# EAGLE design question_3 (EAGLE 8.2.2)
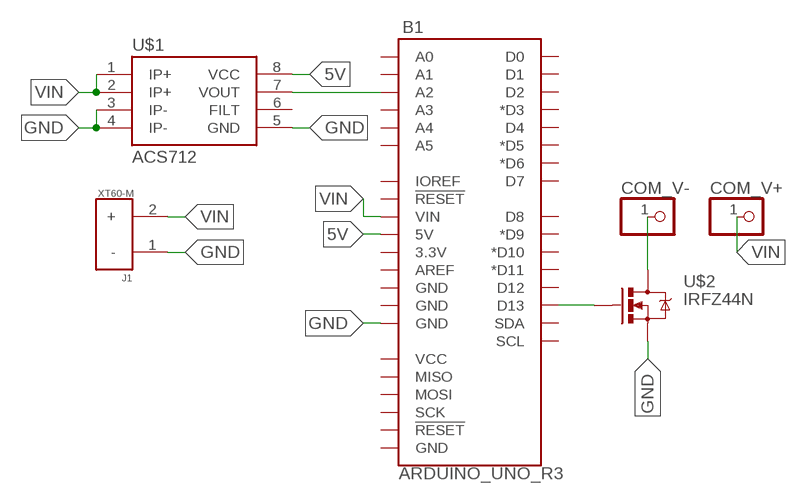
[diagram p0: schematic, sheet 1]

## Parts
B1  ARDUINO_UNO_R3  [ARDUINO_R3]
COM_V+  PINHD-1X1  [1X01]
COM_V-  PINHD-1X1  [1X01]
J1  XT60-M  [AMASS_XT60-M]
U$1  ACS712  [SO08]
U$2  IRFZ44N  [TO-220]

## Nets
5V: B1.5V U$1.8(VCC)
GND: B1.GND@2(GND) J1.1(-) U$1.3(IP-) U$1.4(IP-) U$1.5(GND) U$2.3(S)
N$1: B1.D13 U$2.1(G)
N$3: COM_V-.1 U$2.2(D)
N$5: B1.A2 U$1.7(VOUT)
VIN: B1.VIN COM_V+.1 J1.2(+) U$1.1(IP+) U$1.2(IP+)
Unconnected: B1.3.3V B1.A0 B1.A1 B1.A3 B1.A4 B1.A5 B1.AREF B1.D0 B1.D1 B1.D2 B1.D3(*D3) B1.D4 B1.D5(*D5) B1.D6(*D6) B1.D7 B1.D8 B1.D9(*D9) B1.D10(*D10) B1.D11(*D11) B1.D12 B1.GND@1(GND) B1.GND@3(GND) B1.GND@4(GND) B1.IOREF B1.MISO B1.MOSI B1.RESET@1(!RESET!) B1.RESET@2(!RESET!) B1.SCK B1.SCL B1.SDA B1.VCC U$1.6(FILT)

## Library data of the parts
B1 = SparkFun-Boards:ARDUINO_UNO_R3: Arduino R3 Footprint with SPI header Arduino Uno R3 Compatible Footprint. Matches PCB size of the original board. SparkFun Products: SAMD21 Dev Breakout <https://www.sparkfun.com/products/13672> RedBoard <https://www.sparkfun.com/products/12757> R3 Stackable Headers <https://www.sparkfun.com/products/11417>
COM_V+ COM_V- = adafruit:PINHD-1X1: Pin header 1x1 for 0.1" spacing With round pins
J1 = XT60-M:XT60-M: DC supply; XT60; male; PIN:2; for cable; soldered; 60A; 500V; AVAILABILITY: Unavailable; DESCRIPTION: Plug; DC supply; XT60; male; PIN: 2; for cable; soldered; 30A; 500V; MF: AMASS; MP: XT60-M; PACKAGE: Package; PRICE: None
U$1 = SparkFun-Sensors:ACS712: ACS712 Hall-effect-based isolated linear current sensor Datasheet <http://www.sparkfun.com/datasheets/BreakoutBoards/0712.pdf> SparkFun Products SparkFun Low Current Sensor Breakout - ACS712 <https://www.sparkfun.com/products/8883> (SEN-08883); PROD_ID: IC-08964
U$2 = IRFZ44N:IRFZ44N; AVAILABILITY: Unavailable; DESCRIPTION: N-Channel 55V 49A (Tc) 3.8W (Ta), 94W (Tc) Through Hole TO-262; MF: Infineon Technologies; MP: IRFZ44N; PACKAGE: D2PAK NXP Semiconductors; PRICE: None

## Board
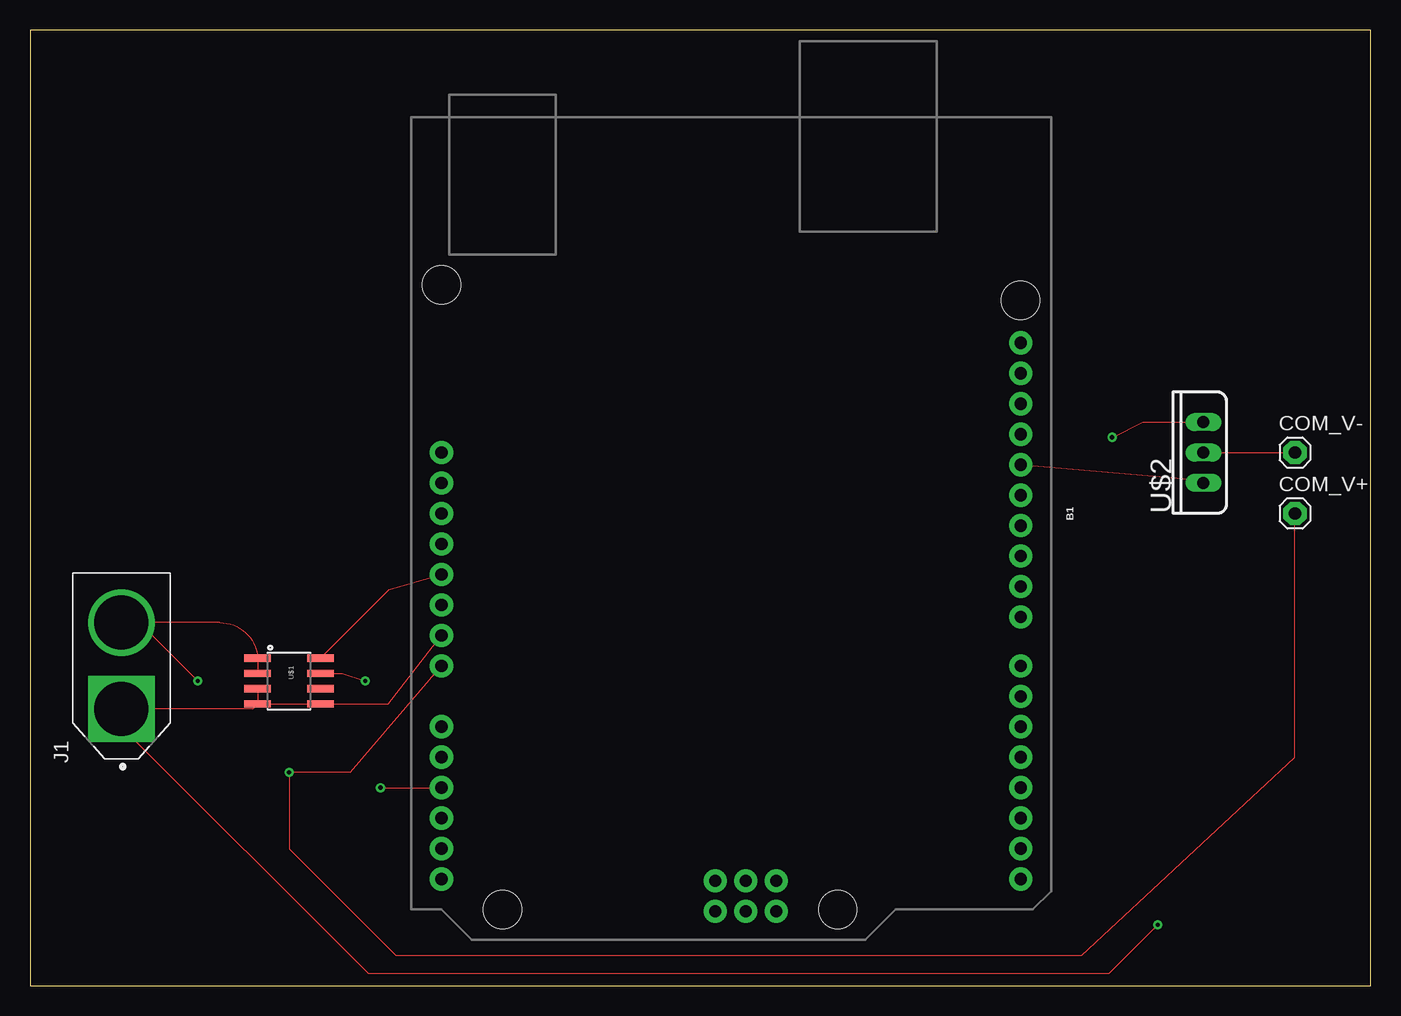
[diagram p1: board, top side]
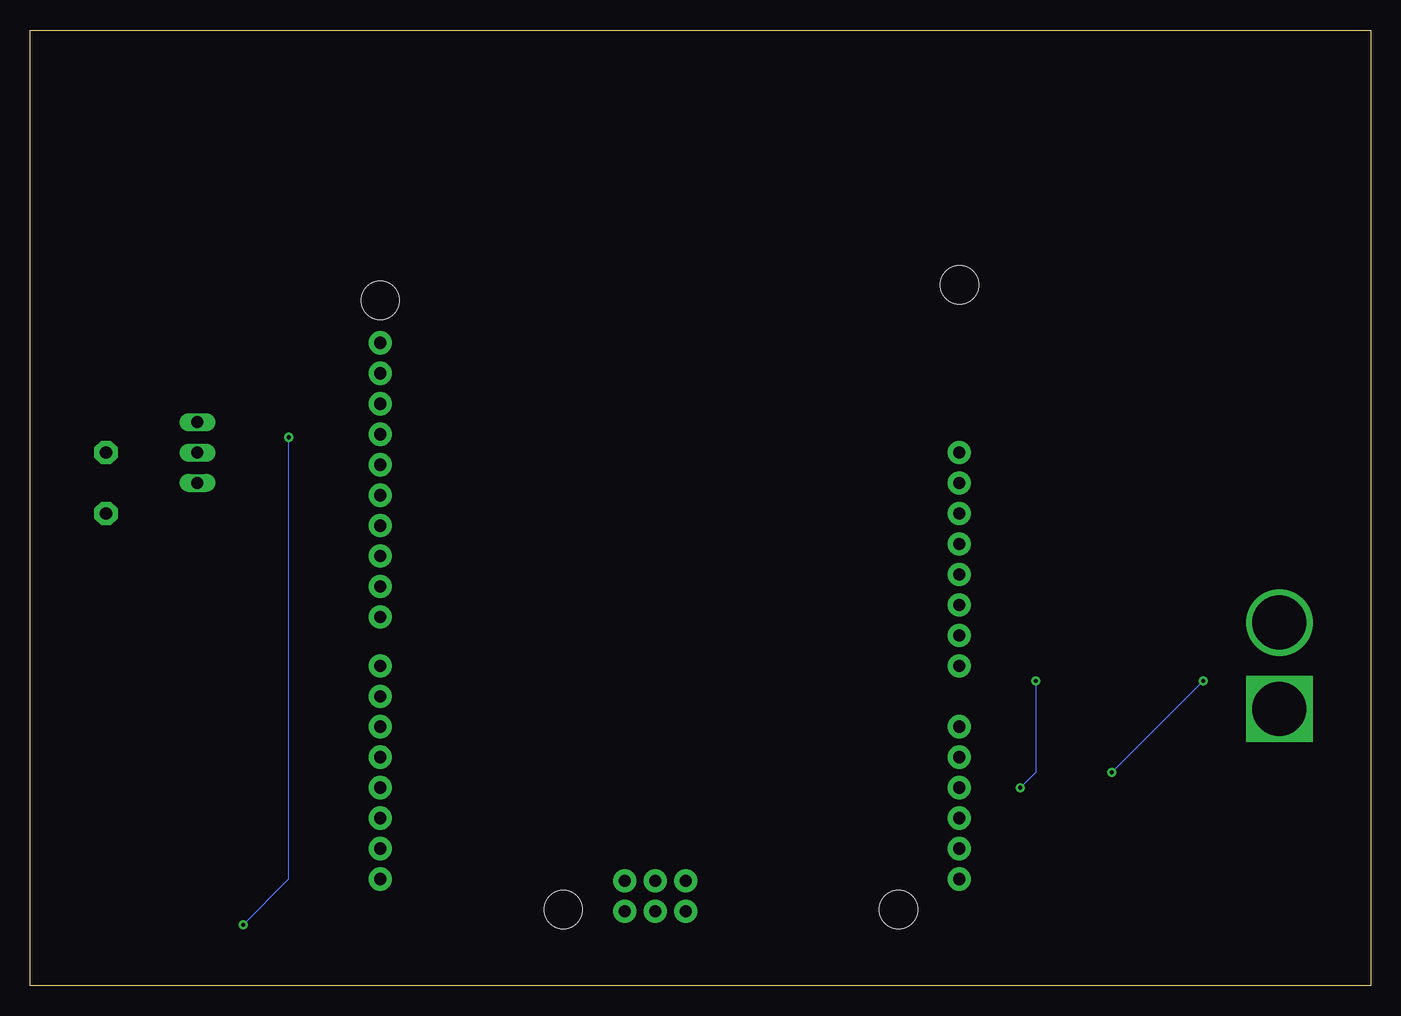
[diagram p2: board, bottom side, seen from below]

Size 111.74 x 79.68 mm. Coordinates in mm from the lower left corner, seen from the top.
Outline: 0,0 111.74,0 111.74,79.68 0,79.68 0,0
Copper layers (1*16): Top 0.035mm / dielectric 1.5mm / Bottom 0.035mm
Design rules "default *": minimum track width 0.00126875mm, minimum drill 0.35mm, track to track 6mil, track to pad 6mil, pad to pad 6mil, via to via 6mil, smd to smd 6mil, copper to edge 40mil, drill to drill 6mil, minimum pad ring 10mil, minimum via ring 8mil, stop-mask expansion 4mil, vias tented up to drill 0mil, thermal gap 10mil

### Footprints (pad centres in the part's own frame; a part is rotated, then mirrored left to right if it is on the bottom)
ARDUINO_R3 = drill 1.016 pad 1.93: 3.3V 2.54,-24.13; 5V 5.08,-24.13; A0 17.78,-24.13; A1 20.32,-24.13; A2 22.86,-24.13; A3 25.4,-24.13; A4 27.94,-24.13; A5 30.48,-24.13; AREF -9.144,24.13; D0 30.48,24.13; D1 27.94,24.13; D2 25.4,24.13; D3 22.86,24.13; D4 20.32,24.13; D5 17.78,24.13; D6 15.24,24.13; D7 12.7,24.13; D8 8.636,24.13; D9 6.096,24.13; D10 3.556,24.13; D11 1.016,24.13; D12 -1.524,24.13; D13 -4.064,24.13; GND@1 7.62,-24.13; GND@2 10.16,-24.13; GND@3 -6.604,24.13; GND@4 33.16,-1.32; IOREF -2.54,-24.13; MISO 30.62,3.76; MOSI 33.16,1.22; NC -5.08,-24.13; RESET@1 0,-24.13; RESET@2 30.62,-1.32; SCK 30.62,1.22; SCL -14.224,24.13; SDA -11.684,24.13; VCC 33.16,3.76; VIN 12.7,-24.13 | hole 3.175: -17.78,24.13; 33.02,8.89; 33.02,-19.05; -19.05,-24.13
1X01 = drill 1.016 pad 1.93 octagon: 1 0,0
AMASS_XT60-M = drill 4.5 square: 1 -3.6,0 | drill 4.5: 2 3.6,0
SO08 = smd 0.61 x 2.21: 1 -1.905,-2.616; 2 -0.635,-2.616; 3 0.635,-2.616; 4 1.905,-2.616; 5 1.905,2.616; 6 0.635,2.616; 7 -0.635,2.616; 8 -1.905,2.616
TO-220 = drill 1 long: 1 -2.54,0; 2 0,0; 3 2.54,0

### Placement (x,y rotation side)
B1  58.42,39.37 270 top
COM_V+  105.41,39.37 0 top
COM_V-  105.41,44.45 0 top
J1  7.62,26.67 90 top
U$1  21.59,25.4 270 top
U$2  97.79,44.45 90 top

### Tracks (layer width: path | path; a pad name or v marks a point on that pad's centre or on a via)
5V
  Top 0.024: U$1.8 29.92,33.02 B1.5V
GND  (via drill 0.35)
  Top 0.007: U$1.3 U$1.4 18.55,23.07 J1.1
  Top 0.024: B1.GND@2 29.84,23.5 U$1.5 U$1.4 | J1.1 7.62,21.59 28.18,1.03 89.93,1.03 v93.98,5.08 | v90.17,45.72 92.71,46.99 U$2.3
  Bottom 0.024: v93.98,5.08 90.17,8.89 v90.17,45.72
N$1
  Top 0.024: B1.D13 97.54,42.16 U$2.1
N$3
  Top 0.024: U$2.2 COM_V-.1
N$5  (via drill 0.35)
  Top 0.024: U$1.7 26.04,26.04 v27.94,25.4 | v29.21,16.51 B1.A2
  Bottom 0.024: v27.94,25.4 27.94,17.78 v29.21,16.51
VIN  (via drill 0.35)
  Top 0.007: 18.97,27.12 U$1.1 | 18.97,27.12 U$1.2 | J1.2 15.82,30.27 arc-90 18.97,27.12
  Top 0.024: J1.2 9.1,30.27 v13.97,25.4 | B1.VIN 26.67,17.78 v21.59,17.78 21.59,11.43 30.48,2.54 87.63,2.54 105.41,19.05 COM_V+.1
  Bottom 0.024: v13.97,25.4 v21.59,17.78